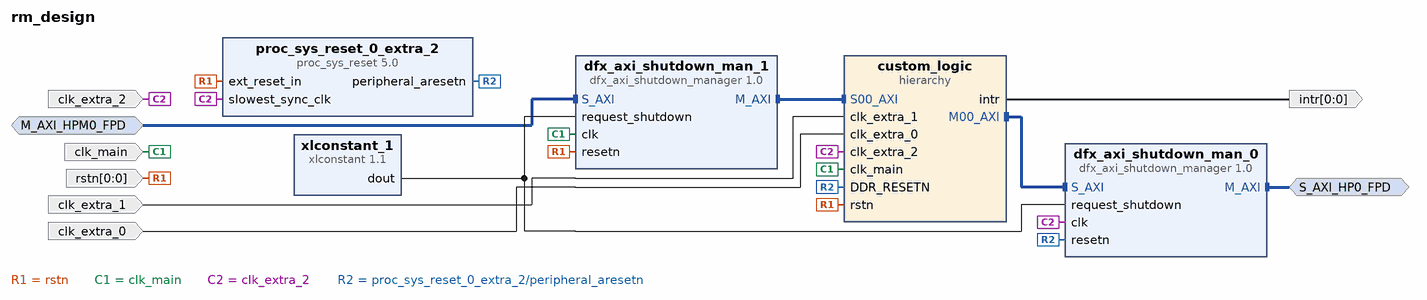
[diagram p0: block diagram of the top level]
# Vivado block design rm_design, xczu7ev-ffvc1156-2-e, Vivado 2020.2
create_bd_design rm_design

create_bd_intf_port -mode Slave -vlnv xilinx.com:interface:aximm_rtl:1.0 M_AXI_HPM0_FPD
set_property -dict [list \
  CONFIG.ADDR_WIDTH 40 \
  CONFIG.ARUSER_WIDTH 16 \
  CONFIG.AWUSER_WIDTH 16 \
  CONFIG.BUSER_WIDTH 0 \
  CONFIG.DATA_WIDTH 128 \
  CONFIG.HAS_BRESP 1 \
  CONFIG.HAS_BURST 1 \
  CONFIG.HAS_CACHE 1 \
  CONFIG.HAS_LOCK 1 \
  CONFIG.HAS_PROT 1 \
  CONFIG.HAS_QOS 1 \
  CONFIG.HAS_REGION 0 \
  CONFIG.HAS_RRESP 1 \
  CONFIG.HAS_WSTRB 1 \
  CONFIG.ID_WIDTH 17 \
  CONFIG.MAX_BURST_LENGTH 256 \
  CONFIG.NUM_READ_OUTSTANDING 8 \
  CONFIG.NUM_READ_THREADS 4 \
  CONFIG.NUM_WRITE_OUTSTANDING 8 \
  CONFIG.NUM_WRITE_THREADS 4 \
  CONFIG.PROTOCOL AXI4 \
  CONFIG.READ_WRITE_MODE READ_WRITE \
  CONFIG.RUSER_BITS_PER_BYTE 0 \
  CONFIG.RUSER_WIDTH 0 \
  CONFIG.SUPPORTS_NARROW_BURST 1 \
  CONFIG.WUSER_BITS_PER_BYTE 0 \
  CONFIG.WUSER_WIDTH 0 \
] [get_bd_intf_ports M_AXI_HPM0_FPD]
create_bd_intf_port -mode Master -vlnv xilinx.com:interface:aximm_rtl:1.0 S_AXI_HP0_FPD
set_property -dict [list \
  CONFIG.ADDR_WIDTH 49 \
  CONFIG.DATA_WIDTH 128 \
  CONFIG.FREQ_HZ 200000000 \
  CONFIG.NUM_READ_OUTSTANDING 16 \
  CONFIG.NUM_WRITE_OUTSTANDING 16 \
  CONFIG.PROTOCOL AXI4 \
] [get_bd_intf_ports S_AXI_HP0_FPD]
create_bd_port -dir I -type clk clk_main
set_property -dict [list \
  CONFIG.ASSOCIATED_BUSIF M_AXI_HPM0_FPD \
  CONFIG.ASSOCIATED_RESET rstn \
  CONFIG.FREQ_HZ 100000000 \
] [get_bd_ports clk_main]
create_bd_port -dir I -type clk clk_extra_0
set_property -dict {CONFIG.FREQ_HZ 75000000} [get_bd_ports clk_extra_0]
create_bd_port -dir I -type clk clk_extra_1
set_property -dict {CONFIG.FREQ_HZ 150000000} [get_bd_ports clk_extra_1]
create_bd_port -dir I -type clk clk_extra_2
set_property -dict {CONFIG.ASSOCIATED_BUSIF S_AXI_HP0_FPD CONFIG.FREQ_HZ 200000000} [get_bd_ports clk_extra_2]
create_bd_port -dir O -from 0 -to 0 -type intr intr
create_bd_port -dir I -from 0 -to 0 -type rst rstn

create_bd_cell -type hier custom_logic
create_bd_cell -type ip -vlnv xilinx.com:ip:dfx_axi_shutdown_manager:1.0 dfx_axi_shutdown_man_0
set_property -dict [list \
  CONFIG.CTRL_INTERFACE_TYPE 0 \
  CONFIG.DP_AXI_ADDR_WIDTH 31 \
  CONFIG.DP_AXI_ARUSER_WIDTH 1 \
  CONFIG.DP_AXI_AWUSER_WIDTH 1 \
  CONFIG.DP_AXI_BUSER_WIDTH 0 \
  CONFIG.DP_AXI_DATA_WIDTH 128 \
  CONFIG.DP_AXI_ID_WIDTH 6 \
  CONFIG.DP_AXI_RUSER_WIDTH 0 \
  CONFIG.DP_AXI_WUSER_WIDTH 0 \
  CONFIG.RP_IS_MASTER true \
] [get_bd_cells dfx_axi_shutdown_man_0]
create_bd_cell -type ip -vlnv xilinx.com:ip:dfx_axi_shutdown_manager:1.0 dfx_axi_shutdown_man_1
set_property -dict {CONFIG.CTRL_INTERFACE_TYPE 0 CONFIG.RP_IS_MASTER false} [get_bd_cells dfx_axi_shutdown_man_1]
create_bd_cell -type ip -vlnv xilinx.com:ip:xlconstant:1.1 xlconstant_1
set_property -dict {CONFIG.CONST_VAL 0} [get_bd_cells xlconstant_1]
create_bd_cell -type ip -vlnv xilinx.com:ip:proc_sys_reset:5.0 proc_sys_reset_0_extra_2

# ---- hierarchy /custom_logic ----
current_bd_instance /custom_logic
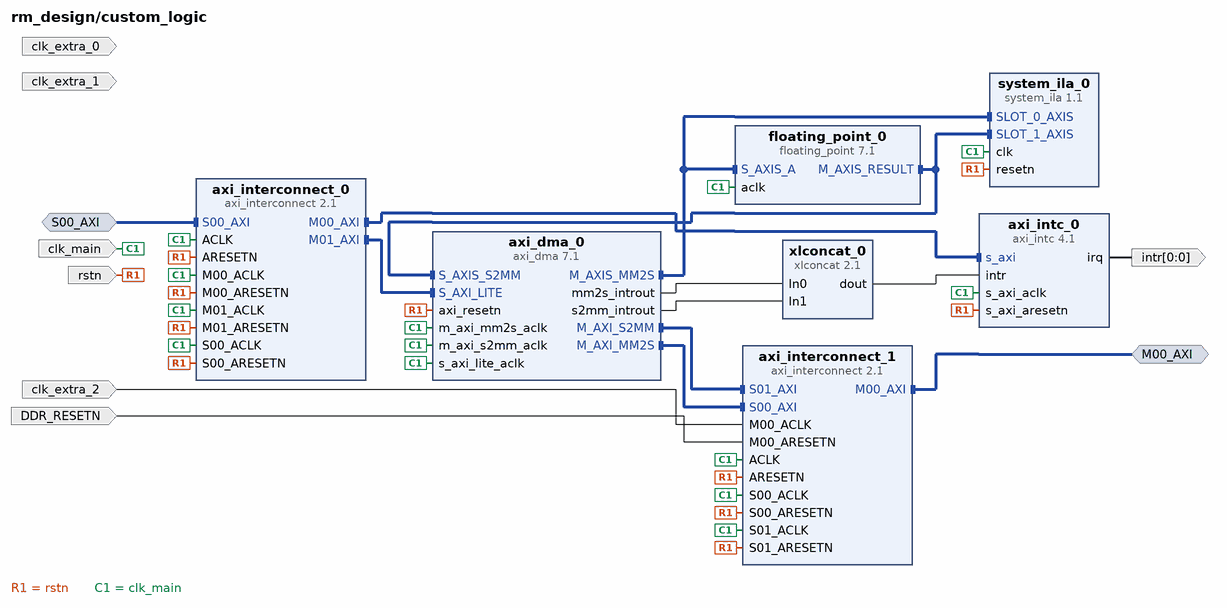
[diagram p1: block diagram inside /custom_logic]
create_bd_intf_pin -mode Master -vlnv xilinx.com:interface:aximm_rtl:1.0 M00_AXI
create_bd_intf_pin -mode Slave -vlnv xilinx.com:interface:aximm_rtl:1.0 S00_AXI
create_bd_pin -dir I -type clk clk_main
create_bd_pin -dir O -from 0 -to 0 -type intr intr
create_bd_pin -dir I -type rst rstn
create_bd_pin -dir I -type clk clk_extra_2
create_bd_pin -dir I -type clk clk_extra_0
create_bd_pin -dir I -type clk clk_extra_1
create_bd_pin -dir I -type rst DDR_RESETN

create_bd_cell -type ip -vlnv xilinx.com:ip:axi_interconnect:2.1 axi_interconnect_0
set_property -dict {CONFIG.NUM_MI 2} [get_bd_cells axi_interconnect_0]
create_bd_cell -type ip -vlnv xilinx.com:ip:axi_dma:7.1 axi_dma_0
set_property -dict [list \
  CONFIG.c_include_sg 0 \
  CONFIG.c_m_axi_mm2s_data_width 32 \
  CONFIG.c_m_axis_mm2s_tdata_width 32 \
  CONFIG.c_mm2s_burst_size 16 \
] [get_bd_cells axi_dma_0]
create_bd_cell -type ip -vlnv xilinx.com:ip:floating_point:7.1 floating_point_0
set_property -dict [list \
  CONFIG.A_Precision_Type Single \
  CONFIG.C_A_Exponent_Width 8 \
  CONFIG.C_A_Fraction_Width 24 \
  CONFIG.C_Accum_Input_Msb 32 \
  CONFIG.C_Accum_Lsb -31 \
  CONFIG.C_Accum_Msb 32 \
  CONFIG.C_Latency 30 \
  CONFIG.C_Mult_Usage Full_Usage \
  CONFIG.C_Rate 1 \
  CONFIG.C_Result_Exponent_Width 8 \
  CONFIG.C_Result_Fraction_Width 24 \
  CONFIG.Has_A_TLAST true \
  CONFIG.Operation_Type Reciprocal \
  CONFIG.RESULT_TLAST_Behv Pass_A_TLAST \
  CONFIG.Result_Precision_Type Single \
] [get_bd_cells floating_point_0]
create_bd_cell -type ip -vlnv xilinx.com:ip:axi_interconnect:2.1 axi_interconnect_1
set_property -dict {CONFIG.NUM_MI 1 CONFIG.NUM_SI 2} [get_bd_cells axi_interconnect_1]
create_bd_cell -type ip -vlnv xilinx.com:ip:axi_intc:4.1 axi_intc_0
set_property -dict {CONFIG.C_IRQ_CONNECTION 1} [get_bd_cells axi_intc_0]
create_bd_cell -type ip -vlnv xilinx.com:ip:xlconcat:2.1 xlconcat_0
create_bd_cell -type ip -vlnv xilinx.com:ip:system_ila:1.1 system_ila_0
set_property -dict [list \
  CONFIG.ALL_PROBE_SAME_MU_CNT 2 \
  CONFIG.C_ADV_TRIGGER false \
  CONFIG.C_DATA_DEPTH 2048 \
  CONFIG.C_EN_STRG_QUAL 1 \
  CONFIG.C_NUM_MONITOR_SLOTS 2 \
  CONFIG.C_PROBE0_MU_CNT 2 \
  CONFIG.C_SLOT 1 \
  CONFIG.C_SLOT_0_INTF_TYPE xilinx.com:interface:axis_rtl:1.0 \
  CONFIG.C_SLOT_1_INTF_TYPE xilinx.com:interface:axis_rtl:1.0 \
  CONFIG.C_TRIGIN_EN false \
  CONFIG.C_TRIGOUT_EN false \
] [get_bd_cells system_ila_0]

# ---- connections ----

current_bd_instance /custom_logic
connect_bd_intf_net [get_bd_intf_pins axi_interconnect_0/M01_AXI] [get_bd_intf_pins axi_dma_0/S_AXI_LITE]
connect_bd_intf_net [get_bd_intf_pins M00_AXI] [get_bd_intf_pins axi_interconnect_1/M00_AXI]
connect_bd_intf_net [get_bd_intf_pins S00_AXI] [get_bd_intf_pins axi_interconnect_0/S00_AXI]
connect_bd_intf_net [get_bd_intf_pins axi_dma_0/M_AXI_S2MM] [get_bd_intf_pins axi_interconnect_1/S01_AXI]
connect_bd_intf_net [get_bd_intf_pins axi_interconnect_1/S00_AXI] [get_bd_intf_pins axi_dma_0/M_AXI_MM2S]
connect_bd_intf_net [get_bd_intf_pins axi_interconnect_0/M00_AXI] [get_bd_intf_pins axi_intc_0/s_axi]
connect_bd_intf_net [get_bd_intf_pins axi_dma_0/M_AXIS_MM2S] [get_bd_intf_pins floating_point_0/S_AXIS_A]
connect_bd_intf_net [get_bd_intf_pins axi_dma_0/M_AXIS_MM2S] [get_bd_intf_pins system_ila_0/SLOT_0_AXIS]
connect_bd_intf_net [get_bd_intf_pins axi_dma_0/S_AXIS_S2MM] [get_bd_intf_pins floating_point_0/M_AXIS_RESULT]
connect_bd_intf_net [get_bd_intf_pins axi_dma_0/S_AXIS_S2MM] [get_bd_intf_pins system_ila_0/SLOT_1_AXIS]
connect_bd_net -net ARESETN_1 [get_bd_pins rstn] \
  [get_bd_pins axi_interconnect_0/ARESETN] [get_bd_pins axi_interconnect_0/M00_ARESETN] \
  [get_bd_pins axi_interconnect_0/S00_ARESETN] [get_bd_pins axi_interconnect_1/S00_ARESETN] \
  [get_bd_pins axi_interconnect_1/S01_ARESETN] [get_bd_pins axi_interconnect_1/ARESETN] [get_bd_pins axi_dma_0/axi_resetn] \
  [get_bd_pins axi_interconnect_0/M01_ARESETN] [get_bd_pins axi_intc_0/s_axi_aresetn] [get_bd_pins system_ila_0/resetn]
connect_bd_net -net clk_to_rm [get_bd_pins clk_main] \
  [get_bd_pins axi_interconnect_0/ACLK] [get_bd_pins axi_interconnect_0/M00_ACLK] [get_bd_pins axi_interconnect_0/S00_ACLK] \
  [get_bd_pins axi_dma_0/m_axi_mm2s_aclk] [get_bd_pins axi_interconnect_1/S00_ACLK] [get_bd_pins floating_point_0/aclk] \
  [get_bd_pins axi_dma_0/m_axi_s2mm_aclk] [get_bd_pins axi_interconnect_1/S01_ACLK] [get_bd_pins axi_interconnect_1/ACLK] \
  [get_bd_pins axi_dma_0/s_axi_lite_aclk] [get_bd_pins axi_interconnect_0/M01_ACLK] [get_bd_pins axi_intc_0/s_axi_aclk] \
  [get_bd_pins system_ila_0/clk]
connect_bd_net [get_bd_pins axi_dma_0/mm2s_introut] [get_bd_pins xlconcat_0/In0]
connect_bd_net [get_bd_pins axi_dma_0/s2mm_introut] [get_bd_pins xlconcat_0/In1]
connect_bd_net [get_bd_pins xlconcat_0/dout] [get_bd_pins axi_intc_0/intr]
connect_bd_net [get_bd_pins axi_intc_0/irq] [get_bd_pins intr]
connect_bd_net -net M00_ACLK_1 [get_bd_pins clk_extra_2] [get_bd_pins axi_interconnect_1/M00_ACLK]
connect_bd_net -net M00_ARESETN_1 [get_bd_pins DDR_RESETN] [get_bd_pins axi_interconnect_1/M00_ARESETN]

current_bd_instance /
connect_bd_intf_net [get_bd_intf_pins custom_logic/S00_AXI] [get_bd_intf_pins dfx_axi_shutdown_man_1/M_AXI]
connect_bd_intf_net [get_bd_intf_ports M_AXI_HPM0_FPD] [get_bd_intf_pins dfx_axi_shutdown_man_1/S_AXI]
connect_bd_intf_net -intf_net axi_interconnect_1_M00_AXI [get_bd_intf_pins custom_logic/M00_AXI] [get_bd_intf_pins dfx_axi_shutdown_man_0/S_AXI]
connect_bd_intf_net [get_bd_intf_ports S_AXI_HP0_FPD] [get_bd_intf_pins dfx_axi_shutdown_man_0/M_AXI]
connect_bd_net -net ARESETN_1 [get_bd_ports rstn] \
  [get_bd_pins custom_logic/rstn] [get_bd_pins dfx_axi_shutdown_man_1/resetn] \
  [get_bd_pins proc_sys_reset_0_extra_2/ext_reset_in]
connect_bd_net -net axi_intc_0_irq [get_bd_pins custom_logic/intr] [get_bd_ports intr]
connect_bd_net -net clk_100MHz [get_bd_ports clk_main] [get_bd_pins custom_logic/clk_main] [get_bd_pins dfx_axi_shutdown_man_1/clk]
connect_bd_net -net clk_extra_1_1 [get_bd_ports clk_extra_1] [get_bd_pins custom_logic/clk_extra_1]
connect_bd_net -net clk_extra_2_1 [get_bd_ports clk_extra_2] \
  [get_bd_pins dfx_axi_shutdown_man_0/clk] [get_bd_pins custom_logic/clk_extra_2] \
  [get_bd_pins proc_sys_reset_0_extra_2/slowest_sync_clk]
connect_bd_net [get_bd_pins xlconstant_1/dout] \
  [get_bd_pins dfx_axi_shutdown_man_1/request_shutdown] [get_bd_pins dfx_axi_shutdown_man_0/request_shutdown]
connect_bd_net -net clk_extra_0_1 [get_bd_ports clk_extra_0] [get_bd_pins custom_logic/clk_extra_0]
connect_bd_net [get_bd_pins proc_sys_reset_0_extra_2/peripheral_aresetn] \
  [get_bd_pins custom_logic/DDR_RESETN] [get_bd_pins dfx_axi_shutdown_man_0/resetn]

# ---- address map ----
assign_bd_address -offset 0x70000000 -range 256M -target_address_space [get_bd_addr_spaces custom_logic/axi_dma_0/Data_MM2S] [get_bd_addr_segs S_AXI_HP0_FPD/Reg]
assign_bd_address -offset 0x70000000 -range 256M -target_address_space [get_bd_addr_spaces custom_logic/axi_dma_0/Data_S2MM] [get_bd_addr_segs S_AXI_HP0_FPD/Reg]
assign_bd_address -offset 0x00A0000000 -range 64K -target_address_space [get_bd_addr_spaces M_AXI_HPM0_FPD] [get_bd_addr_segs custom_logic/axi_dma_0/S_AXI_LITE/Reg]
assign_bd_address -offset 0x00A0010000 -range 64K -target_address_space [get_bd_addr_spaces M_AXI_HPM0_FPD] [get_bd_addr_segs custom_logic/axi_intc_0/S_AXI/Reg]

validate_bd_design
save_bd_design
